# EAGLE schematic naswietlarka (EAGLE 6.5.0)
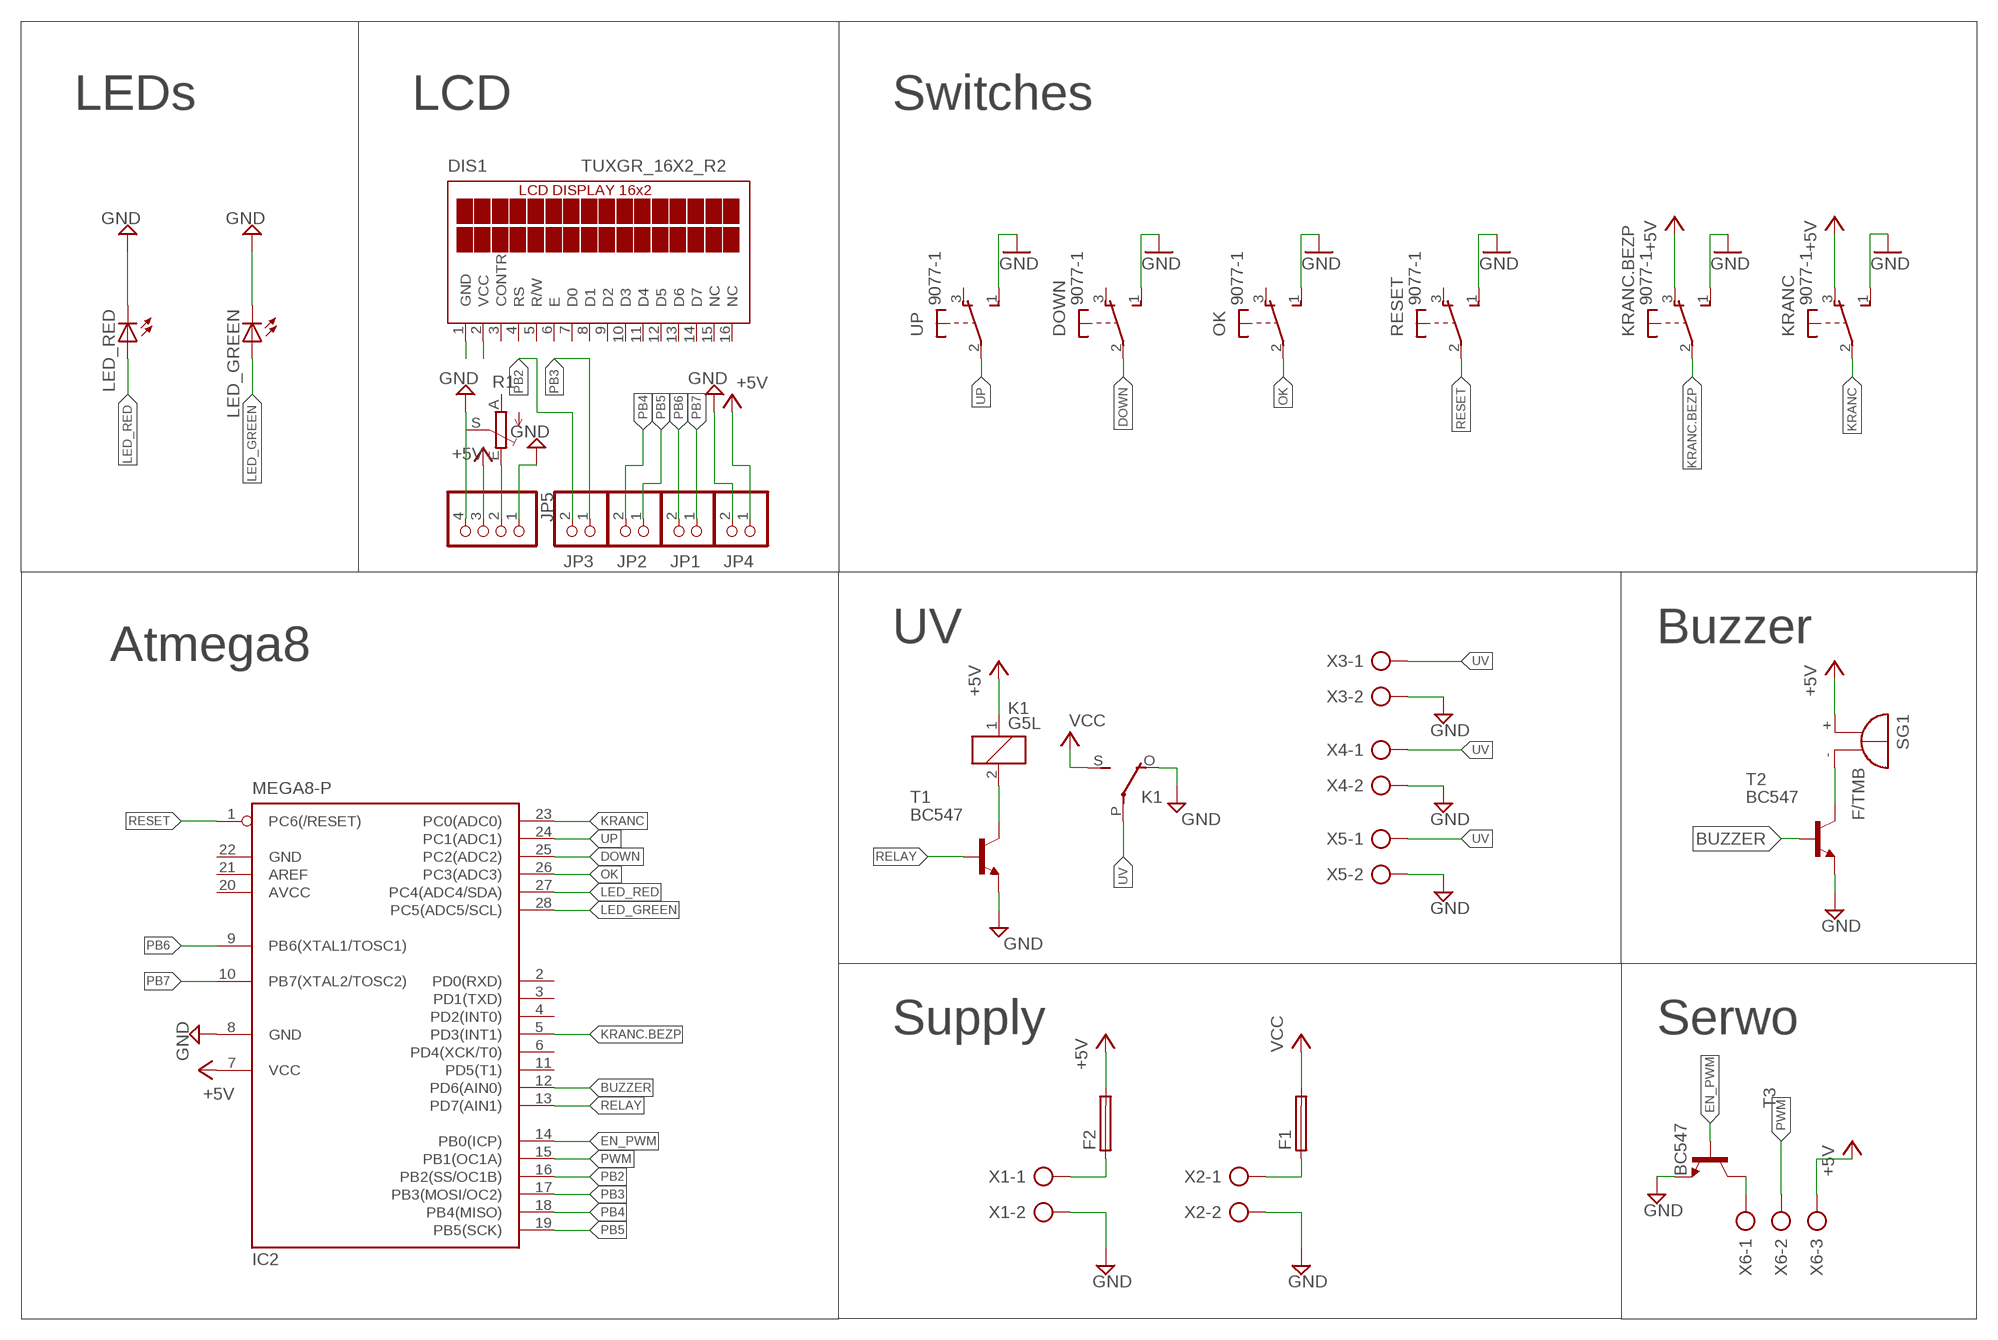
[diagram p0: schematic, sheet 1]

## Parts
DIS1  TUXGR_16X2_R2  [TUXGR_16X2_R2]
DOWN  9077-1  [9077-1]
F1  SH22,5  [SH22,5]
F2  SH22,5  [SH22,5]
IC2  MEGA8-P  [DIL28-3]
JP1  PINHD-1X2  [1X02]
JP2  PINHD-1X2  [1X02]
JP3  PINHD-1X2  [1X02]
JP4  PINHD-1X2  [1X02]
JP5  PINHD-1X4  [1X04]
K1  G5L  [G5LE]
KRANC  9077-1  [9077-1]
KRANC.BEZP  9077-1  [9077-1]
LED_GREEN  LED5MM  [LED5MM]
LED_RED  LED5MM  [LED5MM]
OK  9077-1  [9077-1]
R1  TRIM_EU-CA6V  [CA6V]
RESET  9077-1  [9077-1]
SG1  F/TMB  [F/TMB]
T1  BC547  [TO92]
T2  BC547  [TO92]
T3  BC547  [TO92]
UP  9077-1  [9077-1]
X1  AK500/2-H  [AK500/2-H]
X2  AK500/2-H  [AK500/2-H]
X3  AK500/2-H  [AK500/2-H]
X4  AK500/2-H  [AK500/2-H]
X5  AK500/2-H  [AK500/2-H]
X6  AK500/3-H  [AK500/3-H]

## Nets
+5V: F2.2 IC2.7(VCC) JP4.1 JP5.3 K1.1 KRANC.3(O) KRANC.BEZP.3(O) SG1.+ X6.3
BUZZER: IC2.12(PD6(AIN0)) T2.2(B)
DOWN: DOWN.2(P) IC2.25(PC2(ADC2))
EN_PWM: IC2.14(PB0(ICP)) T3.2(B)
GND: DOWN.1(S) IC2.8(GND) JP4.2 JP5.1 JP5.4 K1.O(2:O) KRANC.1(S) KRANC.BEZP.1(S) LED_GREEN.K(C) LED_RED.K(C) OK.1(S) R1.S RESET.1(S) T1.1(E) T2.1(E) T3.1(E) UP.1(S) X1.2 X2.2 X3.2 X4.2 X5.2
KRANC: IC2.23(PC0(ADC0)) KRANC.2(P)
KRANC.BEZP: IC2.5(PD3(INT1)) KRANC.BEZP.2(P)
LED_GREEN: IC2.28(PC5(ADC5/SCL)) LED_GREEN.A
LED_RED: IC2.27(PC4(ADC4/SDA)) LED_RED.A
N$1: JP5.2 R1.E
N$2: K1.2 T1.3(C)
N$3: F1.1 X2.1
N$4: SG1.- T2.3(C)
N$5: F2.1 X1.1
N$6: DIS1.1(GND)
N$7: DIS1.2(VCC)
N$9: T3.3(C) X6.1
OK: IC2.26(PC3(ADC3)) OK.2(P)
PB2: IC2.16(PB2(SS/OC1B)) JP3.2
PB3: IC2.17(PB3(MOSI/OC2)) JP3.1
PB4: IC2.18(PB4(MISO)) JP2.2
PB5: IC2.19(PB5(SCK)) JP2.1
PB6: IC2.9(PB6(XTAL1/TOSC1)) JP1.2
PB7: IC2.10(PB7(XTAL2/TOSC2)) JP1.1
PWM: IC2.15(PB1(OC1A)) X6.2
RELAY: IC2.13(PD7(AIN1)) T1.2(B)
RESET: IC2.1(PC6(/RESET)) RESET.2(P)
UP: IC2.24(PC1(ADC1)) UP.2(P)
UV: K1.P(2:P) X3.1 X4.1 X5.1
VCC: F1.2 K1.S(2:S)
Unconnected: DIS1.3(CONTR) DIS1.4(RS) DIS1.5(R/W) DIS1.6(E) DIS1.7(D0) DIS1.8(D1) DIS1.9(D2) DIS1.10(D3) DIS1.11(D4) DIS1.12(D5) DIS1.13(D6) DIS1.14(D7) DIS1.15(NC) DIS1.16(NC) DOWN.3(O) IC2.2(PD0(RXD)) IC2.3(PD1(TXD)) IC2.4(PD2(INT0)) IC2.6(PD4(XCK/T0)) IC2.11(PD5(T1)) IC2.21(AREF) OK.3(O) R1.A RESET.3(O) UP.3(O)

## Notes on the sheet
- LEDs | LCD | Switches
- UV | Buzzer
- Atmega8
- Supply | Serwo

## Power pins joined to a net without a drawn wire
AVCC: IC2.20(AVCC)
GND: IC2.22(GND)

## Library data of the parts
DIS1 = display-lcd:TUXGR_16X2_R2: Tuxgraphics LCD display 16x2 characters reflective, without background light Source: tuxgr_12x2_r2.pdf; OC_FARNELL: unknown; OC_NEWARK: unknown
DOWN KRANC KRANC.BEZP OK RESET UP = switch-misc:9077-1: MARQUARDT SWITCH 9077.0100 Distributor: Buerklin <https://www.buerklin.com/default.asp?event=ShowArtikel%2812G2820%29&l=d&jump=ArtNr_12G2820>
F1 F2 = fuse:SH22,5: FUSE HOLDER grid 22,5 mm, OGN0031 8201, Schurter (Buerklin); MF: SCHURTER; MPN: 0031.8201; OC_FARNELL: 1162740; OC_NEWARK: 96F8317
IC2 = atmel:MEGA8-P: MICROCONTROLLER 8 Kbytes FLASH, 1 kbytes SRAM, 512 bytes EEPROM, USART, 4-channel 10 bit ADC, 2-channel 8 bit ADC Pin compatible with Atmega48, ATMega88, ATMega168 Source: avr.lbr; OC_FARNELL: unknown; OC_NEWARK: unknown
JP1-JP4 = pinhead:PINHD-1X2: PIN HEADER
JP5 = pinhead:PINHD-1X4: PIN HEADER
K1 = relay:G5L: RELAY 1 x switch, 10 A/120 V AC, 8 A/30 V ADC, Omron; OC_FARNELL: unknown; OC_NEWARK: unknown
LED_GREEN LED_RED = led:LED: LED OSRAM: - CHIPLED LG R971, LG N971, LY N971, LG Q971, LY Q971, LO R971, LY R971 LH N974, LH R974 LS Q976, LO Q976, LY Q976 LO Q996 - Hyper CHIPLED LW Q18S LB Q993, LB Q99A, LB R99A - SideLED LS A670, LO A670, LY A670, LG A670, LP A670 LB A673, LV A673, LT A673, LW A673 LH A674 LY A675 LS A676, LA A676, LO A676, LY A676, LW A676 LS A679, LY A679, LG A679 - Hyper Micro SIDELED® LS Y876, LA Y876, LO Y876, LY Y876 LT Y87S - SmartLED LW L88C, LW L88S LB L89C, LB L89S, LG L890 LS L89K, LO L89K, LY L89K LS L896, LA L896, LO L896, LY L896 - TOPLED LS T670, LO T670, LY T670, LG T670, LP T670 LSG T670, LSP T670, LSY T670, LOP T670, LYG T670 LG T671, LOG T671, LSG T671 LB T673, LV T673, LT T673, LW T673 LH T674 LS T676, LA T676, LO T676, LY T676, LB T676, LH T676, LSB T676, LW T676 LB T67C, LV T67C, LT T67C, LS T67K, LO T67K, LY T67K, LW E67C LS E67B, LA E67B, LO E67B, LY E67B, LB E67C, LV E67C, LT E67C LW T67C LS T679, LY T679, LG T679 LS T770, LO T770, LY T770, LG T770, LP T770 LB T773, LV T773, LT T773, LW T773 LH T774 LS E675, LA E675, LY E675, LS T675 LS T776, LA T776, LO T776, LY T776, LB T776 LHGB T686 LT T68C, LB T68C - Hyper Mini TOPLED® LB M676 - Mini TOPLED Santana® LG M470 LS M47K, LO M47K, LY M47K Source: http://www.osram.convergy.de LUXEON: - LUMILED® LXK2-PW12-R00, LXK2-PW12-S00, LXK2-PW14-U00, LXK2-PW14-V00 LXK2-PM12-R00, LXK2-PM12-S00, LXK2-PM14-U00 LXK2-PE12-Q00, LXK2-PE12-R00, LXK2-PE12-S00, LXK2-PE14-T00, LXK2-PE14-U00 LXK2-PB12-K00, LXK2-PB12-L00, LXK2-PB12-M00, LXK2-PB14-N00, LXK2-PB14-P00, LXK2-PB14-Q00 LXK2-PR12-L00, LXK2-PR12-M00, LXK2-PR14-Q00, LXK2-PR14-R00 LXK2-PD12-Q00, LXK2-PD12-R00, LXK2-PD12-S00 LXK2-PH12-R00, LXK2-PH12-S00 LXK2-PL12-P00, LXK2-PL12-Q00, LXK2-PL12-R00 Source: www.luxeon.com KINGBRIGHT: KA-3528ASYC Source: www.kingbright.com
R1 = pot:TRIM_EU-: POTENTIOMETER
SG1 = buzzer:F/TMB: BUZZER Source: Buerklin; OC_FARNELL: unknown; OC_NEWARK: unknown
T1-T3 = transistor:BC547: NPN TRANSISTOR
X1-X5 = con-ptr500:AK500/2-H: CONNECTOR Aug. 2004 / PTR Meßtechnik: Die Bezeichnung der Serie AK505 wurde geändert. Es handelt sich hierbei um AK500 in horizontaler Ausführung.; OC_FARNELL: unknown; OC_NEWARK: unknown
X6 = con-ptr500:AK500/3-H: CONNECTOR Aug. 2004 / PTR Meßtechnik: Die Bezeichnung der Serie AK505 wurde geändert. Es handelt sich hierbei um AK500 in horizontaler Ausführung.; OC_FARNELL: unknown; OC_NEWARK: unknown